# Altium project PowerBoard.PrjPCB
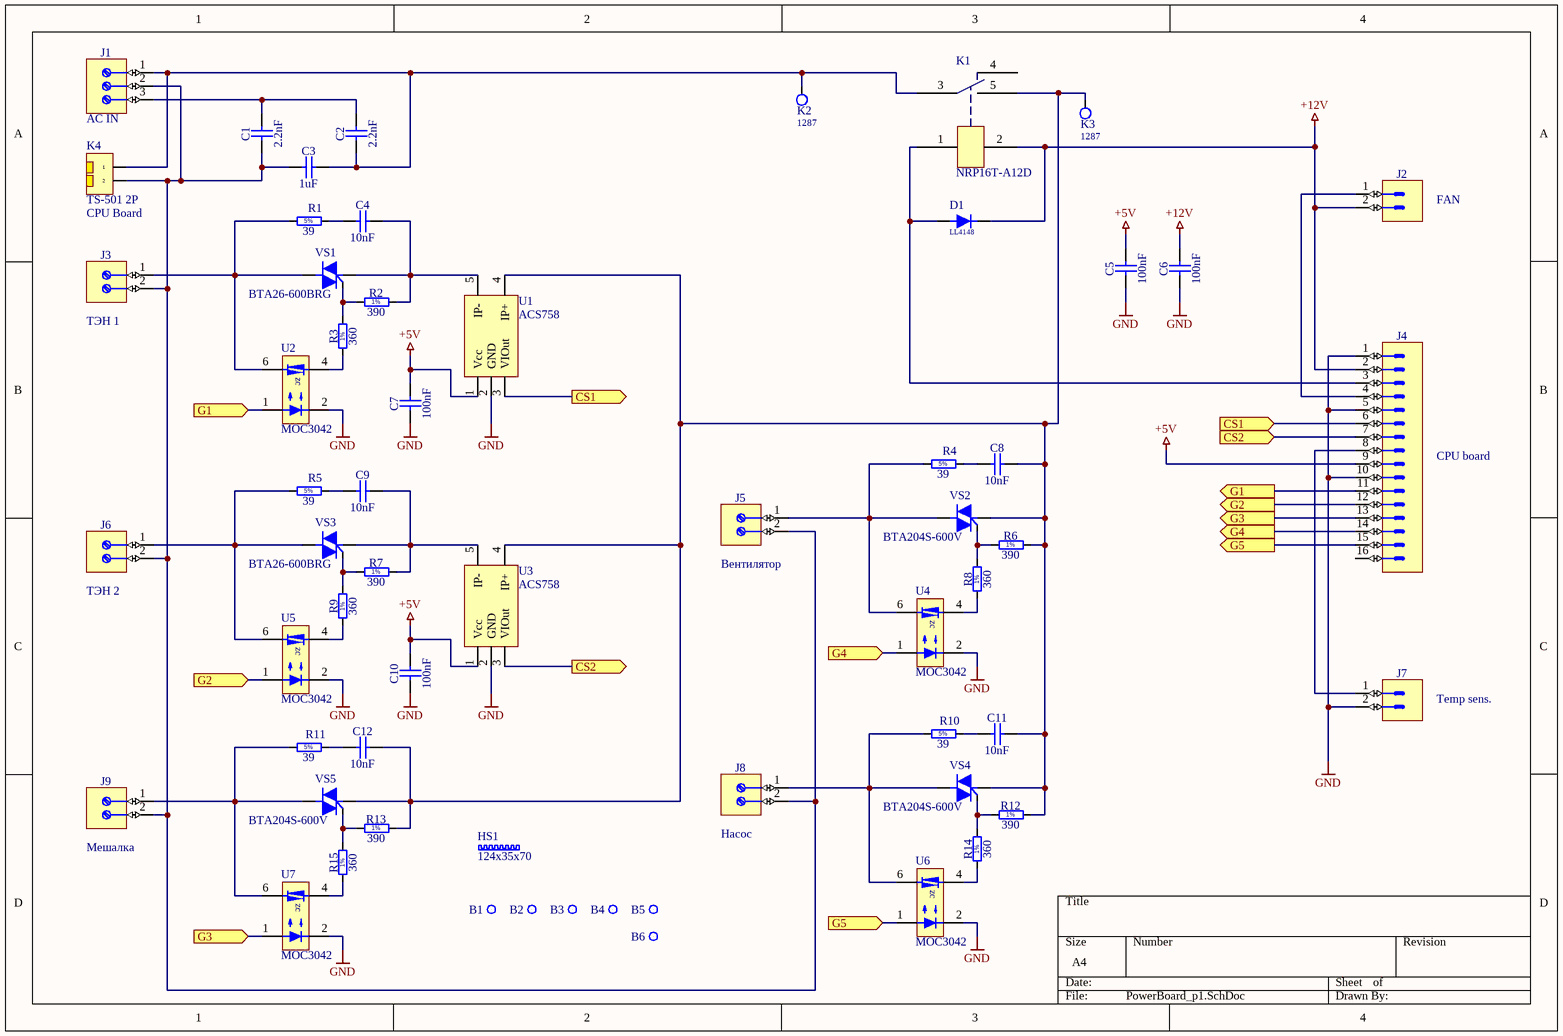
[diagram p0: PowerBoard_p1.SchDoc]
1 sheet, 60 parts. Net scope: flat (ports and power ports of the same name join across sheets).
Board file: PM_PowerBoard_PCB.PcbDoc

## Sheet PowerBoard_p1.SchDoc
size A4

### Parts
B1  Plated Hole  [MTG350_650]  (value not drawn)
B2  Plated Hole  [MTG350_650]  (value not drawn)
B3  Plated Hole  [MTG350_650]  (value not drawn)
B4  Plated Hole  [MTG350_650]  (value not drawn)
B5  Plated Hole  [MTG350_650]  (value not drawn)
B6  Plated Hole  [MTG350_650]  (value not drawn)
C1  2.2nF  [CAPRB_MURATA_DHRE4AD222Z4QB]
C2  2.2nF  [CAPRB_MURATA_DHRE4AD222Z4QB]
C3  1uF  [CAPR2750-1300X3150X2400]
C4  10nF  [CAPR500-300X720X650]
C5  100nF  [CAPC2012X135N]
C6  100nF  [CAPC2012X135N]
C7  100nF  [CAPC2012X135N]
C8  10nF  [CAPR500-300X720X650]
C9  10nF  [CAPR500-300X720X650]
C10  100nF  [CAPC2012X135N]
C11  10nF  [CAPR500-300X720X650]
C12  10nF  [CAPR500-300X720X650]
D1  LL4148  [SOD80/MLL34]
HS1  124x35x70  [HeadSink 124x35x70]
J1  (no value)  [PHOENIX_1714968]
J2  KK®  [MOLEX_22-27-2021]  (value not drawn)
J3  (no value)  [PHOENIX_1715721]
J4  Header 16  [3M_N2516-6002RB]  (value not drawn)
J5  (no value)  [PHOENIX_1715721]
J6  (no value)  [PHOENIX_1715721]
J7  KK®  [MOLEX_22-27-2021]  (value not drawn)
J8  (no value)  [PHOENIX_1715721]
J9  (no value)  [PHOENIX_1715721]
K1  NRP16T-A12D  [NRP16T]
K2  1287  [Keystone 1287]
K3  1287  [Keystone 1287]
K4  TS-501 2P  [TS-501 2P-2.5]
R1  39  [RESADV508-1670X520]
R2  390  [RES1016-630X250]
R3  360  [RES1016-630X250]
R4  39  [RESADV508-1670X520]
R5  39  [RESADV508-1670X520]
R6  390  [RES1016-630X250]
R7  390  [RES1016-630X250]
R8  360  [RES1016-630X250]
R9  360  [RES1016-630X250]
R10  39  [RESADV508-1670X520]
R11  39  [RESADV508-1670X520]
R12  390  [RES1016-630X250]
R13  390  [RES1016-630X250]
R14  360  [RES1016-630X250]
R15  360  [RES1016-630X250]
U1  ACS758  [CB Package]
U2  MOC3042  [DIL6-300b]
U3  ACS758  [CB Package]
U4  MOC3042  [DIL6-300b]
U5  MOC3042  [DIL6-300b]
U6  MOC3042  [DIL6-300b]
U7  MOC3042  [DIL6-300b]
VS1  BTA26-600BRG  [TOP3-h34mm]
VS2  BTA204S-600V  [TO-252-3L (DPAK)]
VS3  BTA26-600BRG  [TOP3-h34mm]
VS4  BTA204S-600V  [TO-252-3L (DPAK)]
VS5  BTA204S-600V  [TO-252-3L (DPAK)]

### Ports
CS1 (in), CS1 (out), CS2 (in), CS2 (out), G1 (in), G1 (out), G2 (in), G2 (out), G3 (in), G3 (out), G4 (in), G4 (out), G5 (in), G5 (out)

### Nets
+5V: C5.2 C7.2 C10.2 J4.9 U1.1(Vcc) U3.1(Vcc)
+12V: C6.2 D1.2(C) J2.2 J4.2 K1.2
GND: C5.1 C6.1 C7.1 C10.1 J4.1 J4.5 J4.10 J7.2 U1.2(GND) U2.2 U3.2(GND) U4.2 U5.2 U6.2 U7.2
NetC1_1: C1.1 C3.1 J1.2 J3.2 J5.2 J6.2 J8.2 J9.2 K4.2
NetC1_2: C1.2 C2.2 J1.3
NetC2_1: C2.1 C3.2 J1.1 K1.3 K2.1 K4.1
NetC4_1: C4.1 R1.2
NetC4_2: C4.2 R2.2 U1.5(IP-) VS1.1(A1)
NetC8_1: C8.1 R4.2
NetC8_2: C8.2 C11.2 C12.2 K1.5 K3.1 R6.2 R12.2 R13.2 U1.4(IP+) U3.4(IP+) VS2.1(A1) VS4.1(A1) VS5.1(A1)
NetC9_1: C9.1 R5.2
NetC9_2: C9.2 R7.2 U3.5(IP-) VS3.1(A1)
NetC11_1: C11.1 R10.2
NetC12_1: C12.1 R11.2
NetD1_1: D1.1(A) J4.3 K1.1
NetJ2_1: J2.1 J4.4
NetJ3_1: J3.1 R1.1 U2.6 VS1.2(A2)
NetJ4_6: J4.6 U1.3(VIOut) ; port CS1
NetJ4_7: J4.7 U3.3(VIOut) ; port CS2
NetJ4_8: J4.8 J7.1
NetJ4_11: J4.11 U2.1 ; port G1
NetJ4_12: J4.12 U5.1 ; port G2
NetJ4_13: J4.13 U7.1 ; port G3
NetJ4_14: J4.14 U4.1 ; port G4
NetJ4_15: J4.15 U6.1 ; port G5
NetJ5_1: J5.1 R4.1 U4.6 VS2.2(A2)
NetJ6_1: J6.1 R5.1 U5.6 VS3.2(A2)
NetJ8_1: J8.1 R10.1 U6.6 VS4.2(A2)
NetJ9_1: J9.1 R11.1 U7.6 VS5.2(A2)
NetR2_1: R2.1 R3.2 VS1.3(G)
NetR3_1: R3.1 U2.4
NetR6_1: R6.1 R8.2 VS2.3(G)
NetR7_1: R7.1 R9.2 VS3.3(G)
NetR8_1: R8.1 U4.4
NetR9_1: R9.1 U5.4
NetR12_1: R12.1 R14.2 VS4.3(G)
NetR13_1: R13.1 R15.2 VS5.3(G)
NetR14_1: R14.1 U6.4
NetR15_1: R15.1 U7.4

Not connected (* = marked no-connect by the designer): B1 1; B2 1; B3 1; B4 1; B5 1; B6 1; J4 16; K1 4

### Notes on the sheet
- (near J1) AC IN
- (near K4) CPU Board
- FAN
- (near J3) ТЭН 1
- CPU board
- (near J5) Вентилятор
- (near J6) ТЭН 2
- Temp sens.
- (near J9) Мешалка
- (near J8) Насос
- (in symbol MOC3042) zc
- (in symbol RMF_39R_5%_3W_250PPM_508-1670X520_v) 5%
- (in symbol RMF_360R_1%_0.6W_50PPM_1016-630X250) 1%
- (in symbol RMF_390R_1%_0.6W_50PPM_1016-630X250) 1%

### Library data of the parts
B1-B6 = PLATED_HOLE3.5_PAD6.5: Single Terminal Socket; Part Description: Plated Through Hole: Hole Dia.=3.5mm Pad Dia.=6.5mm; Mounted: No; Table: Pads; Part Number: PLATED_HOLE3.5_PAD6.5; Component Kind: Standard (No BOM); Component Type: Standard (No BOM); Pin Count: 1; Family: Plated Hole; Socket: No; SMD: No; Status: None; ComponentHeight: 0mm; Author: CERN DEM JLC; CreateDate: 20.11.2008; LatestRevisionDate: 23.11.2011; PackageDescription: Plated Through Hole: Hole Dia.=3.5mm Pad Dia.=6.5mm
C1 C2 = CCR_2.2NF_7.5KV_+80%-20%_MURATA_DHRE4AD222Z4QB: Non-polarised capacitor; Part Description: High Voltage Ceramic Capacitor; Manufacturer: MURATA; Voltage: 7.5kV; TC: Z5U; Table: Capacitors THD; Part Number: CCR_2.2NF_7.5KV_+80%-20%_MURATA_DHRE4AD222Z4QB; Component Kind: Standard; Component Type: Standard; Pin Count: 2; Value: 2.2nF; Status: Obsolete; Tolerance: +80%-20%; Manufacturer Part Number: DHRE4AD222Z4QB; Case: LS9.5 W75 x D15; Mounted: Yes; Socket: No; SMD: No; ComponentHeight: 20mm; HelpURL: \\cern.ch\dfs\Applications\Altium\Datasheets\CCR_MURATA_DHRE4AD222Z4QB.pdf; Author: CERN DEM JLC; CreateDate: 26.09.2012; LatestRevisionDate: 26.09.2012
C3 = CPPR_1UF_275VAC_20%_2750-1300X3150X2400: Non-polarised capacitor; Part Description: Metallized Polypropylene RFI Capacitor Class X2 (MKP-X2); Manufacturer: WIMA; Manufacturer Part Number: MKX21W41006D00MSSD; Voltage: 275VAC; Tolerance: ±20%; Table: Capacitors THD; Part Number: CPPR_1UF_275VAC_20%_2750-1300X3150X2400; Component Kind: Standard; Component Type: Standard; Pin Count: 2; Value: 1uF; Status: None; Case: LS27.5 W13 x L31.5 x H24; Mounted: Yes; Socket: No; SMD: No; ComponentHeight: 24mm; HelpURL: \\cern.ch\dfs\Applications\Altium\Datasheets\CPPR_WIMA_MKP-X2.pdf; Author: CERN DEM JLC; CreateDate: 23.06.2008; LatestRevisionDate: 30.01.2012
C4 C8 C9 C11 C12 = CPER_10NF_400V_10%_500-300X720X650: Non-polarised capacitor; Part Description: Metallized Polyester Film Capacitor (MKT); Manufacturer: EPCOS; Manufacturer Part Number: B32529C6103K000; Voltage: 400VDC/200VAC; Tolerance: ±10%; Table: Capacitors THD; Part Number: CPER_10NF_400V_10%_500-300X720X650; Component Kind: Standard; Component Type: Standard; Pin Count: 2; Value: 10nF; Status: None; Case: LS5 W3 x L7.2 x H6.5; Mounted: Yes; Socket: No; SMD: No; ComponentHeight: 6.5mm; HelpURL: \\cern.ch\dfs\Applications\Altium\Datasheets\CPER_EPCOS_B32529.pdf; Author: CERN DEM JLC; CreateDate: 23.03.2009; LatestRevisionDate: 23.03.2009
C5-C7 C10 = CC0805_100NF_50V_10%_X7R: Non-polarised capacitor; Part Description: SMD Multilayer Chip Ceramic Capacitor; Manufacturer: GENERIC; Manufacturer1 Part Number: B37941K5104K62; Voltage: 50V; TC: X7R; Tolerance: ±10%; Table: Capacitors SMD; Part Number: CC0805_100NF_50V_10%_X7R; Component Kind: Standard; Component Type: Standard; Pin Count: 2; Value: 100nF; Status: Preferred; Manufacturer Part Number: CC0805_100NF_50V_10%_X7R; Case: 0805; Mounted: Yes; Socket: No; SMD: Yes; Manufacturer1 Example: EPCOS; Manufacturer1 ComponentHeight: 1.35mm; HelpURL: \\cern.ch\dfs\Applications\Altium\Datasheets\CC0805_X7R_EPCOS.pdf; Author: CERN DEM JLC; CreateDate: 03.12.2007; LatestRevisionDate: 03.12.2007
D1 = LL4148: 75V 0.3A SOD80/MLL34; Price: 0.006
HS1 = HeadSink 124x35x70: INDEL A5724/7; Price: 5
J1 = PHOENIX_1714968: Terminal Block, 3 Positions, Screw Connection; Part Description: 30A, 300V, Terminal Block, Pitch 6.35mm, 3 Positions, Screw Connection; Manufacturer: PHOENIX CONTACT; Manufacturer Part Number: 1714968 (MKDS 5/ 3-6,35); Part Number: PHOENIX_1714968; Component Kind: Standard; Component Type: Standard; Pin Count: 3; Mounted: Yes; Socket: No; SMD: No; Status: None; ComponentHeight: 21.5mm; HelpURL: \\cern.ch\dfs\Applications\Altium\Datasheets\PHOENIX_1714968.pdf; Author: CERN DEM JLC; CreateDate: 25.10.2011; LatestRevisionDate: 25.10.2011; Table: PHOENIX
J2 J7 = MOLEX_22-27-2021: Connector 2 Male; Part Description: 2.54mm (.100") Pitch KK® Wire-to-Board Header, Vertical, with Friction Lock, 2 Circuits, Tin (Sn) Plating; Manufacturer: MOLEX; Part Number: MOLEX_22-27-2021; Component Kind: Standard; Component Type: Standard; Pin Count: 2; Family: KK®; Mounted: Yes; Socket: No; SMD: No; Status: None; Manufacturer Part Number: 22-27-2021; ComponentHeight: 11.7mm; HelpURL: \\cern.ch\dfs\Applications\Altium\Datasheets\MOLEX_22-27-2021.pdf; Author: CERN DEM JLC; CreateDate: 04.12.2008; LatestRevisionDate: 04.12.2008; Table: MOLEX
J3 J5 J6 J8 J9 = PHOENIX_1715721: Terminal Block, 2 Positions, Screw Connection; Part Description: 17.5A, 400V, Terminal Block, Pitch 5.08mm, 2 Positions, Screw Connection; Manufacturer: PHOENIX CONTACT; Manufacturer Part Number: 1715721 (MKDS 1,5/2-5,08); Part Number: PHOENIX_1715721; Component Kind: Standard; Component Type: Standard; Pin Count: 2; Mounted: Yes; Socket: No; SMD: No; Status: None; ComponentHeight: 13.8mm; HelpURL: \\cern.ch\dfs\Applications\Altium\Datasheets\PHOENIX_1715721.pdf; Author: CERN DEM JLC; CreateDate: 06.01.2010; LatestRevisionDate: 25.02.2013; Table: PHOENIX
J4 = 3M_N2516-6002RB: Connector 16 Male; Part Description: 16 Contacts - Straight .100'' x .100'' Low Profile Four-Wall Header, 2500 Series; Manufacturer: 3M; Part Number: 3M_N2516-6002RB; Component Kind: Standard; Component Type: Standard; Pin Count: 16; Family: Header 16; Mounted: Yes; Socket: No; SMD: No; Status: None; Manufacturer Part Number: N2516-6002RB; ComponentHeight: 10.03mm; HelpURL: \\cern.ch\dfs\Applications\Altium\Datasheets\3M_N2516-6002RB.pdf; Author: CERN DEM JLC; CreateDate: 11.02.2009; LatestRevisionDate: 11.08.2009; Table: 3M
K1 = Relay NRP16T-A12D
K2 K3 = Keystone 1287: Price: 0.01
K4 = TS-501 2P: 10A/300V AC 5mm; Price: 0.27
R1 R4 R5 R10 R11 = RMF_39R_5%_3W_250PPM_508-1670X520_v: Resistor - 5%; Part Description: Leaded Power Metal Film Resistor (Vertical Mount) PR03 Series; Manufacturer: GENERIC; Manufacturer1 Part Number: PR03000203909JAC00; Power: 3W; TC: ±250ppm/°C; Table: Resistors THD; Part Number: RMF_39R_5%_3W_250PPM_508-1670X520_v; Component Kind: Standard; Component Type: Standard; Pin Count: 2; Value: 39; Status: Preferred; Tolerance: ±5%; Manufacturer Part Number: RMF_39R_5%_3W_250PPM_508-1670X520; Case: LS5.08 L16.7 x D5.2; Mounted: Yes; Socket: No; SMD: No; ComponentHeight: 23.6mm; Manufacturer1 Example: VISHAY BCCOMPONENT; Manufacturer1 ComponentHeight: 23.6mm; HelpURL: \\cern.ch\dfs\Applications\Altium\Datasheets\RMF_VISHAY_PR03.pdf; Author: CERN DEM JLC; CreateDate: 29.10.2012; LatestRevisionDate: 29.10.2012
R2 R6 R7 R12 R13 = RMF_390R_1%_0.6W_50PPM_1016-630X250: Resistor - 1%; Part Description: Leaded Metal Film Resistor; Manufacturer: GENERIC; Manufacturer1 Part Number: MBB02070C3900FCT00; Power: 0.6W; TC: ±50ppm/°C; Table: Resistors THD; Part Number: RMF_390R_1%_0.6W_50PPM_1016-630X250; Component Kind: Standard; Component Type: Standard; Pin Count: 2; Value: 390; Status: Preferred; Tolerance: ±1%; Manufacturer Part Number: RMF_390R_1%_0.6W_50PPM_1016-630X250; Case: LS10.16 L6.3 x D2.5; Mounted: Yes; Socket: No; SMD: No; ComponentHeight: 2.5mm; Manufacturer1 Example: VISHAY BEYSCHLAG; Manufacturer1 ComponentHeight: 2.5mm; HelpURL: \\cern.ch\dfs\Applications\Altium\Datasheets\RMF_VISHAY_MBB0207.pdf; Author: CERN DEM JLC; CreateDate: 04.12.2007; LatestRevisionDate: 07.04.2008
R3 R8 R9 R14 R15 = RMF_360R_1%_0.6W_50PPM_1016-630X250: Resistor - 1%; Part Description: Leaded Metal Film Resistor; Manufacturer: GENERIC; Manufacturer1 Part Number: MBB02070C3600FCT00; Power: 0.6W; TC: ±50ppm/°C; Table: Resistors THD; Part Number: RMF_360R_1%_0.6W_50PPM_1016-630X250; Component Kind: Standard; Component Type: Standard; Pin Count: 2; Value: 360; Status: Preferred; Tolerance: ±1%; Manufacturer Part Number: RMF_360R_1%_0.6W_50PPM_1016-630X250; Case: LS10.16 L6.3 x D2.5; Mounted: Yes; Socket: No; SMD: No; ComponentHeight: 2.5mm; Manufacturer1 Example: VISHAY BEYSCHLAG; Manufacturer1 ComponentHeight: 2.5mm; HelpURL: \\cern.ch\dfs\Applications\Altium\Datasheets\RMF_VISHAY_MBB0207.pdf; Author: CERN DEM JLC; CreateDate: 04.12.2007; LatestRevisionDate: 07.04.2008